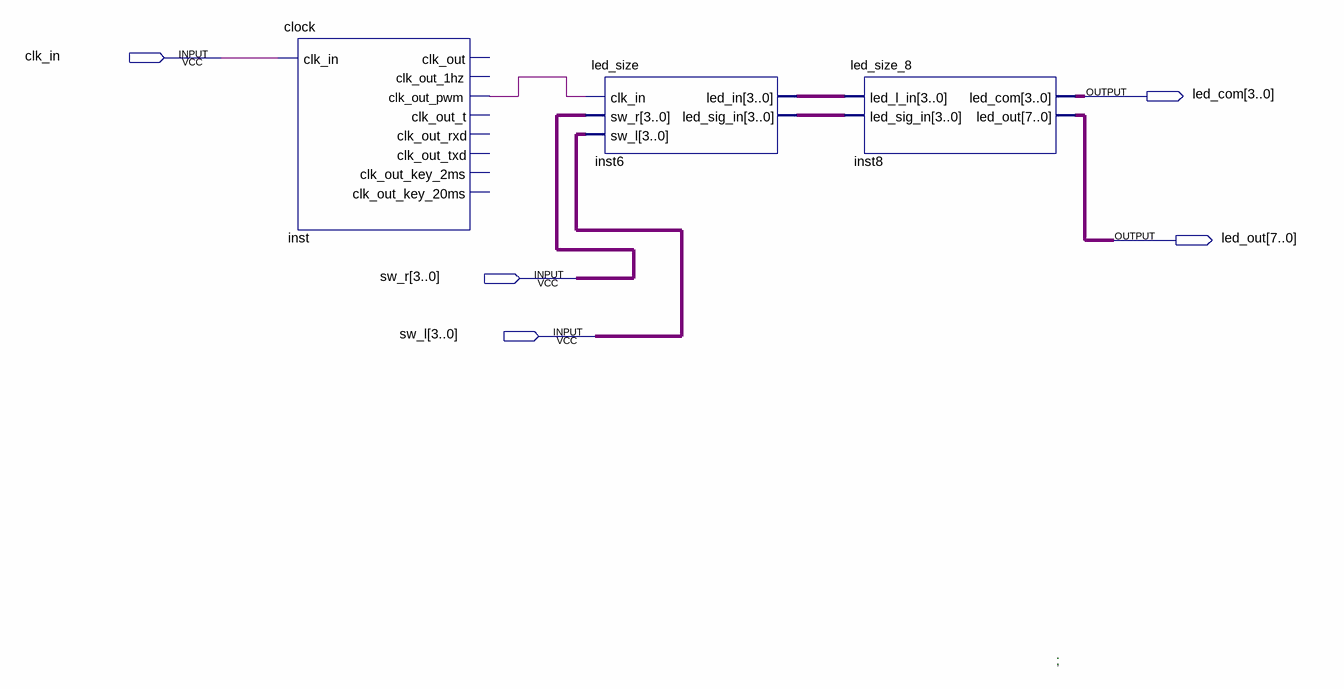
[diagram p0: schematic sheet]
// Quartus schematic led_size_bdf.bdf as structural Verilog: 3 symbols, 5 pins
module led_size_bdf (
  input  clk_in,
  input  [3:0] sw_r,
  input  [3:0] sw_l,
  output [3:0] led_com,
  output [7:0] led_out
);

  wire inst_clk_out_pwm;
  wire [3:0] inst6_led_in, inst6_led_sig_in;

  clock inst (
    .clk_in(clk_in), .clk_out_pwm(inst_clk_out_pwm));  // open: clk_out, clk_out_1hz, clk_out_t, clk_out_rxd, clk_out_txd, clk_out_key_2ms, clk_out_key_20ms
  led_size inst6 (
    .clk_in(inst_clk_out_pwm), .sw_r(sw_r), .sw_l(sw_l), .led_in(inst6_led_in), .led_sig_in(inst6_led_sig_in));
  led_size_8 inst8 (.led_l_in(inst6_led_in), .led_sig_in(inst6_led_sig_in), .led_com(led_com), .led_out(led_out));

  // Notes on the sheet:
  //   ;
endmodule
